# Altium schematic sheet MA-Power.SchDoc
size A4; SheetNumber: 4; SheetTotal: 7
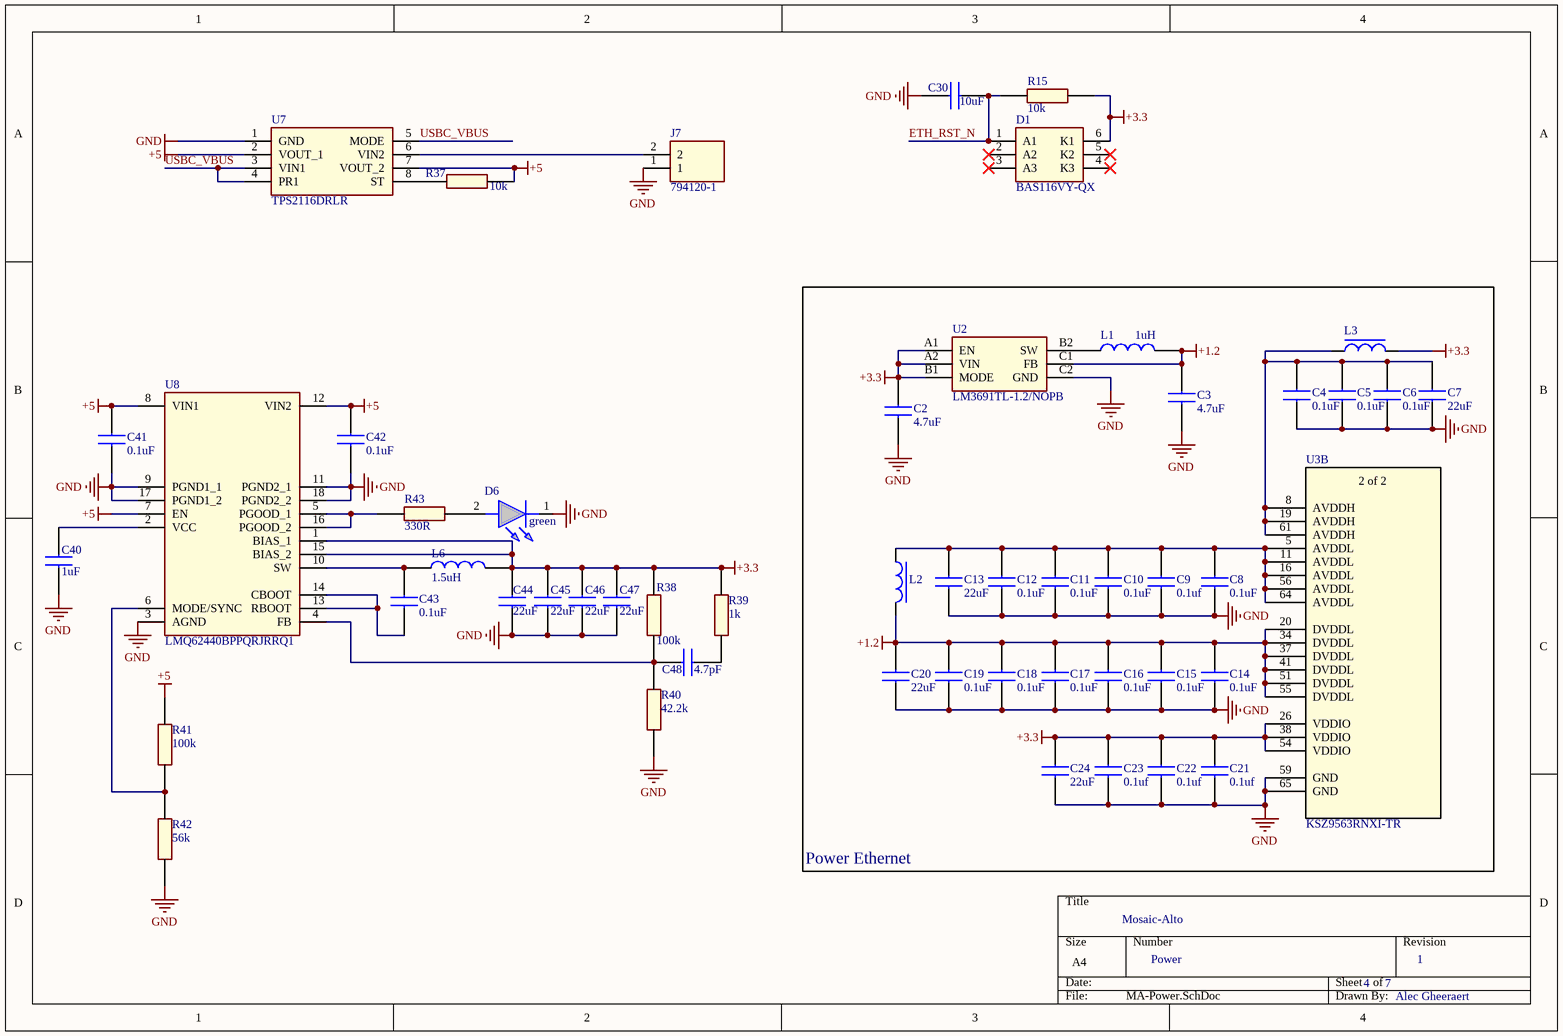
[diagram p0: MA-Power.SchDoc]

## Parts
C2  4.7uF  [CAPC1608X100N]
C3  4.7uF  [CAPC1608X100N]
C4  0.1uF  [CAPC1005X55N]
C5  0.1uF  [CAPC1005X55N]
C6  0.1uF  [CAPC1005X55N]
C7  22uF  [CAPC2012X145N]
C8  0.1uF  [CAPC1005X55N]
C9  0.1uf  [CAPC1005X55N]
C10  0.1uF  [CAPC1005X55N]
C11  0.1uF  [CAPC1005X55N]
C12  0.1uF  [CAPC1005X55N]
C13  22uF  [CAPC2012X145N]
C14  0.1uF  [CAPC1005X55N]
C15  0.1uF  [CAPC1005X55N]
C16  0.1uF  [CAPC1005X55N]
C17  0.1uF  [CAPC1005X55N]
C18  0.1uF  [CAPC1005X55N]
C19  0.1uF  [CAPC1005X55N]
C20  22uF  [CAPC2012X145N]
C21  0.1uf  [CAPC1005X55N]
C22  0.1uf  [CAPC1005X55N]
C23  0.1uf  [CAPC1005X55N]
C24  22uF  [CAPC2012X145N]
C30  10uF  [CAPC1608X100N]
C40  1uF  [CAPC1608X100N]
C41  0.1uF  [CAPC2012X145N]
C42  0.1uF  [CAPC2012X145N]
C43  0.1uF  [CAPC1005X55N]
C44  22uF  [CAPC2012X145N]
C45  22uF  [CAPC2012X145N]
C46  22uF  [CAPC2012X145N]
C47  22uF  [CAPC2012X145N]
C48  4.7pF  [CAPC1608X87N]
D1  BAS116VY-QX  [BAS116VYQX]
D6  green  [APT1608ZGCAMT]
J7  794120-1  [7941201]
L1  1uH  [INDC2016X100N]
L2  MPZ1608S121ATDH5  [BEADC1608X75N]  (value not drawn)
L3  MPZ1608S121ATDH5  [BEADC1608X75N]  (value not drawn)
L6  1.5uH  [INDC1005X55N]
R15  10k  [RESC1005X40N]
R37  10k  [RESC1005X40N]
R38  100k  [RESC1005X40N]
R39  1k  [RESC1005X40N]
R40  42.2k  [RESC1005X40N]
R41  100k  [RESC1005X40N]
R42  56k  [RESC1005X40N]
R43  330R  [RESC1005X40N]
U2  LM3691TL-1.2/NOPB  [BGA6C50P2X3_126X156X68]
U3  KSZ9563RNXI-TR  [VQFN64_NX_MCH]  (part B of 2)
U7  TPS2116DRLR  [SOTFL50P160X60-8N]
U8  LMQ62440BPPQRJRRQ1  [LMQ62440BPPQRJRRQ1]

## Blocks framed on the sheet
Power Ethernet: C2-C24 L1-L3 U2 U3

## Nets
+1.2: C3.1 C14.1 C15.1 C16.1 C17.1 C18.1 C19.1 C20.1 L1.2 L2.2 U2.C1(FB) U3.20(DVDDL) U3.34(DVDDL) U3.37(DVDDL) U3.41(DVDDL) U3.51(DVDDL) U3.55(DVDDL)
+3.3: C2.1 C21.1 C22.1 C23.1 C24.1 C44.1 C45.1 C46.1 C47.1 D1.6(K1) L3.2 L6.2 R15.1 R38.1 R39.2 U2.A1(EN) U2.A2(VIN) U2.B1(MODE) U3.26(VDDIO) U3.38(VDDIO) U3.54(VDDIO) U8.1(BIAS_1) U8.15(BIAS_2)
+5: C41.1 C42.1 R37.2 R41.2 U7.2(VOUT_1) U7.7(VOUT_2) U8.7(EN) U8.8(VIN1) U8.12(VIN2)
GND: C2.2 C3.2 C4.2 C5.2 C6.2 C7.2 C8.2 C9.2 C10.2 C11.2 C12.2 C13.2 C14.2 C15.2 C16.2 C17.2 C18.2 C19.2 C20.2 C21.2 C22.2 C23.2 C24.2 C30.2 C40.2 C41.2 C42.2 C44.2 C45.2 C46.2 C47.2 D6.1(K) J7.1 R40.2 R42.2 U2.C2(GND) U3.59(GND) U3.65(GND) U7.1(GND) U8.3(AGND) U8.9(PGND1_1) U8.11(PGND2_1) U8.17(PGND1_2) U8.18(PGND2_2)
ETH_RST_N: C30.1 D1.1(A1) R15.2
USBC_VBUS: U7.3(VIN1) U7.4(PR1) U7.5(MODE)
NetC4_1: C4.1 C5.1 C6.1 C7.1 L3.1 U3.8(AVDDH) U3.19(AVDDH) U3.61(AVDDH)
NetC8_1: C8.1 C9.1 C10.1 C11.1 C12.1 C13.1 L2.1 U3.5(AVDDL) U3.11(AVDDL) U3.16(AVDDL) U3.56(AVDDL) U3.64(AVDDL)
NetC40_1: C40.1 U8.2(VCC)
NetC43_1: C43.1 L6.1 U8.10(SW)
NetC43_2: C43.2 U8.13(RBOOT) U8.14(CBOOT)
NetC48_1: C48.1 R38.2 R40.1 U8.4(FB)
NetC48_2: C48.2 R39.1
NetD6_2: D6.2(A) R43.2
NetJ7_2: J7.2 U7.6(VIN2)
NetL1_1: L1.1 U2.B2(SW)
NetR37_1: R37.1 U7.8(ST)
NetR41_1: R41.1 R42.1 U8.6(MODE/SYNC)
NetR43_1: R43.1 U8.5(PGOOD_1) U8.16(PGOOD_2)

Not connected (* = marked no-connect by the designer): D1 2(A2)* 3(A3)* 4(K3)* 5(K2)*

## Notes on the sheet
- Mosaic-Alto
- Power
- 4
- 7
- 1
- Alec Gheeraert
- (in symbol CMP-00057-8, part B) 2 of 2

## Library data of the parts
C2 C3 = CMP-00054-2: 0603 4.7µF; Manufacturer: Walsin; Tolerance: 20%; Voltage Rating: 6.3V; Dielectric: X5R; Max Operating Temperature: 85; Capacitance: 4.7µF; Min Operating Temperature: -55; Package: 0603
C4-C6 C8-C12 C14-C19 C21-C23 C43 = CMP-00051-3: 0402I 0.1µF; Manufacturer: Walsin; Tolerance: 10%; Dielectric: X7R; Capacitance: 100nF; Voltage Rating: 10V; Min Operating Temperature: -55; Package: 0402; Max Operating Temperature: 125
C7 C13 C20 C24 C44-C47 = CMP-00053-2: 0805 22µF; Manufacturer: Walsin; Tolerance: 10%; Dielectric: X5R; Voltage Rating: 6.3V; Min Operating Temperature: 85; Capacitance: 22µF; Max Operating Temperature: -55; Package: 0805
C30 = CMP-00062-1: 0603 10µF; Manufacturer: Walsin; Dielectric: X5R; Voltage Rating: 6.3V; Tolerance: 10%; Max Operating Temperature: 85; Min Operating Temperature: -55; Package: 0603; Capacitance: 10µF
C40 = CMP-00064-1: 0603 1µF; Manufacturer: Walsin; Tolerance: 10%; Dielectric: X5R; Voltage Rating: 6.3V; Package: 0603; Min Operating Temperature: -55; Max Operating Temperature: 85; Capacitance: 1µF
C41 C42 = CMP-00059-1: 0805I 0.1µF; Manufacturer: Walsin; Voltage Rating: 50V; Capacitance: 100nF; Qualification: AEC-Q200; Dielectric: X7R; Tolerance: 10%; Min Operating Temperature: 125; Max Operating Temperature: -55; Package: 0805
C48 = CMP-00085-1: 0603 4.7pF; Manufacturer: Walsin; Voltage Rating: 16V; Tolerance: 5%; Dielectric: C0G; Min Operating Temperature: -55; Package: 0603; Capacitance: 4.7pF; Max Operating Temperature: 125
D1 = CMP-00061-3: Triple Diode Array; Manufacturer: Nexperia; Forward Current: 180mA; Max Surge Current: 10A; Forward Voltage: 1.25V; Peak Reverse Voltage: 85V; Reverse Current: 5nA; Configuration: Triple; Package: TSSOP-6
D6 = CMP-00079-2: 0603 Green LED; Colour: Green
J7 = CMP-00082-2: Right Angle PCB Header
L1 = CMP-00048-2: 1µH Inductor; Manufacturer: TDK; Shielding: Yes; Max Current: 1.3A; Tolerance: 20%; Max Resistance: 90; Package: 0806; Inductance: 1µH; Min Operating Temperature: -40; Max Operating Temperature: 125
L2 L3 = CMP-00050-4: 0603I 120ohms Ferrite Bead; Manufacturer: TDK; Tolerance: 25%; Qualification: AEC-Q200; Resistance Rating: 120; Current Rating: 2A; Max Operating Temperature: 125; Min Operating Temperature: -55; Package: 0603
L6 = CMP-00083-2: 1.5uH Inductor
R15 R37 = CMP-00026-5: 0402I 10k; Manufacturer: Walsin; Qualification: AEC-Q200; Tolerance: 1%; Voltage Rating: 50V; Power Rating: 62.5mW; Max Operating Temperature: 155; Resistance: 10k; Package: 0402; Min Operating Temperature: -55
R38 R41 = CMP-00029-4: 0402I 100k; Manufacturer: Walsin; Voltage Rating: 50V; Power Rating: 62.5mW; Qualification: AEC-Q200; Tolerance: 1%; Package: 0402; Resistance: 100k; Max Operating Temperature: 155; Min Operating Temperature: -55
R39 = CMP-00032-3: 0402I 1k; Manufacturer: Walsin; Voltage Rating: 50V; Qualification: AEC-Q200; Power Rating: 62.5mW; Tolerance: 1%; Max Operating Temperature: 155; Resistance: 1k; Package: 0402; Min Operating Temperature: -55
R40 = CMP-00084-1: 0402I 42.2k; Manufacturer: Walsin; Power Rating: 62.5mW; Tolerance: 1%; Voltage Rating: 50V; Qualification: AEC-Q200; Resistance: 42.2k; Max Operating Temperature: 155; Min Operating Temperature: -55; Package: 0402
R42 = CMP-00075-1: 0402I 56k; Manufacturer: Walsin; Tolerance: 1%; Qualification: AEC-Q200; Voltage Rating: 50V; Power Rating: 62.5mW; Package: 0402; Resistance: 56k; Min Operating Temperature: -55; Max Operating Temperature: 155
R43 = CMP-00028-4: 0402I 330; Manufacturer: Walsin; Resistance: 330; Qualification: AEC-Q200; Voltage Rating: 50V; Tolerance: 1%; Power Rating: 62.5mW; Max Operating Temperature: 155; Package: 0402; Min Operating Temperature: -55
U2 = CMP-00047-3: 1.2V 1A Buck Converter; Manufacturer: Texas Instruments; Channels: 1; Max Input Voltage: 5.5V; Min Input Voltage: 2.3V; Frequency: 4MHz; Min Operating Temperature: -30; Topology: Buck; Max Output Voltage: 1.2V; Max Operating Temperature: 85; Min Output Voltage: 1.2V; Package: DSBGA-6; Output Current: 1A
U3 = CMP-00057-8: 3-Port Gigabit Ethernet Switch; Manufacturer: Texas Instruments; Transceivers: 2; Interfaces: I2C, MII, RGMII, RMII, SPI; Data Rate: 10/100/1000; Ethernet Type: 10/1000 Base-T, 100 Base-TX; Package: VQFN-64; Min Operating Temperature: -40; Max Operating Temperature: 85
U7 = CMP-00080-3: 2.5A Power Multiplexer; Manufacturer: Texas Instruments; Max Input Voltage: 5.5V; Outputs: 1; Min Input Voltage: 1.6V; Current Rating: 2.5A; Min Operating Temperature: -40; Max Operating Temperature: 105
U8 = CMP-00081-2: 3.3V 4A Switching Voltage Regulator; Manufacturer: Texas Instruments; Min Input Voltage: 3V; Max Input Voltage: 36V; Topology: Buck; Frequency: 2.1MHz; Channels: 1; Max Output Voltage: 3.3V; Max Operating Temperature: 150; Min Output Voltage: 3.3V; Min Operating Temperature: -40; Output Current: 4A; Package: VQFN-14